# EAGLE design base_board (EAGLE 5.10)
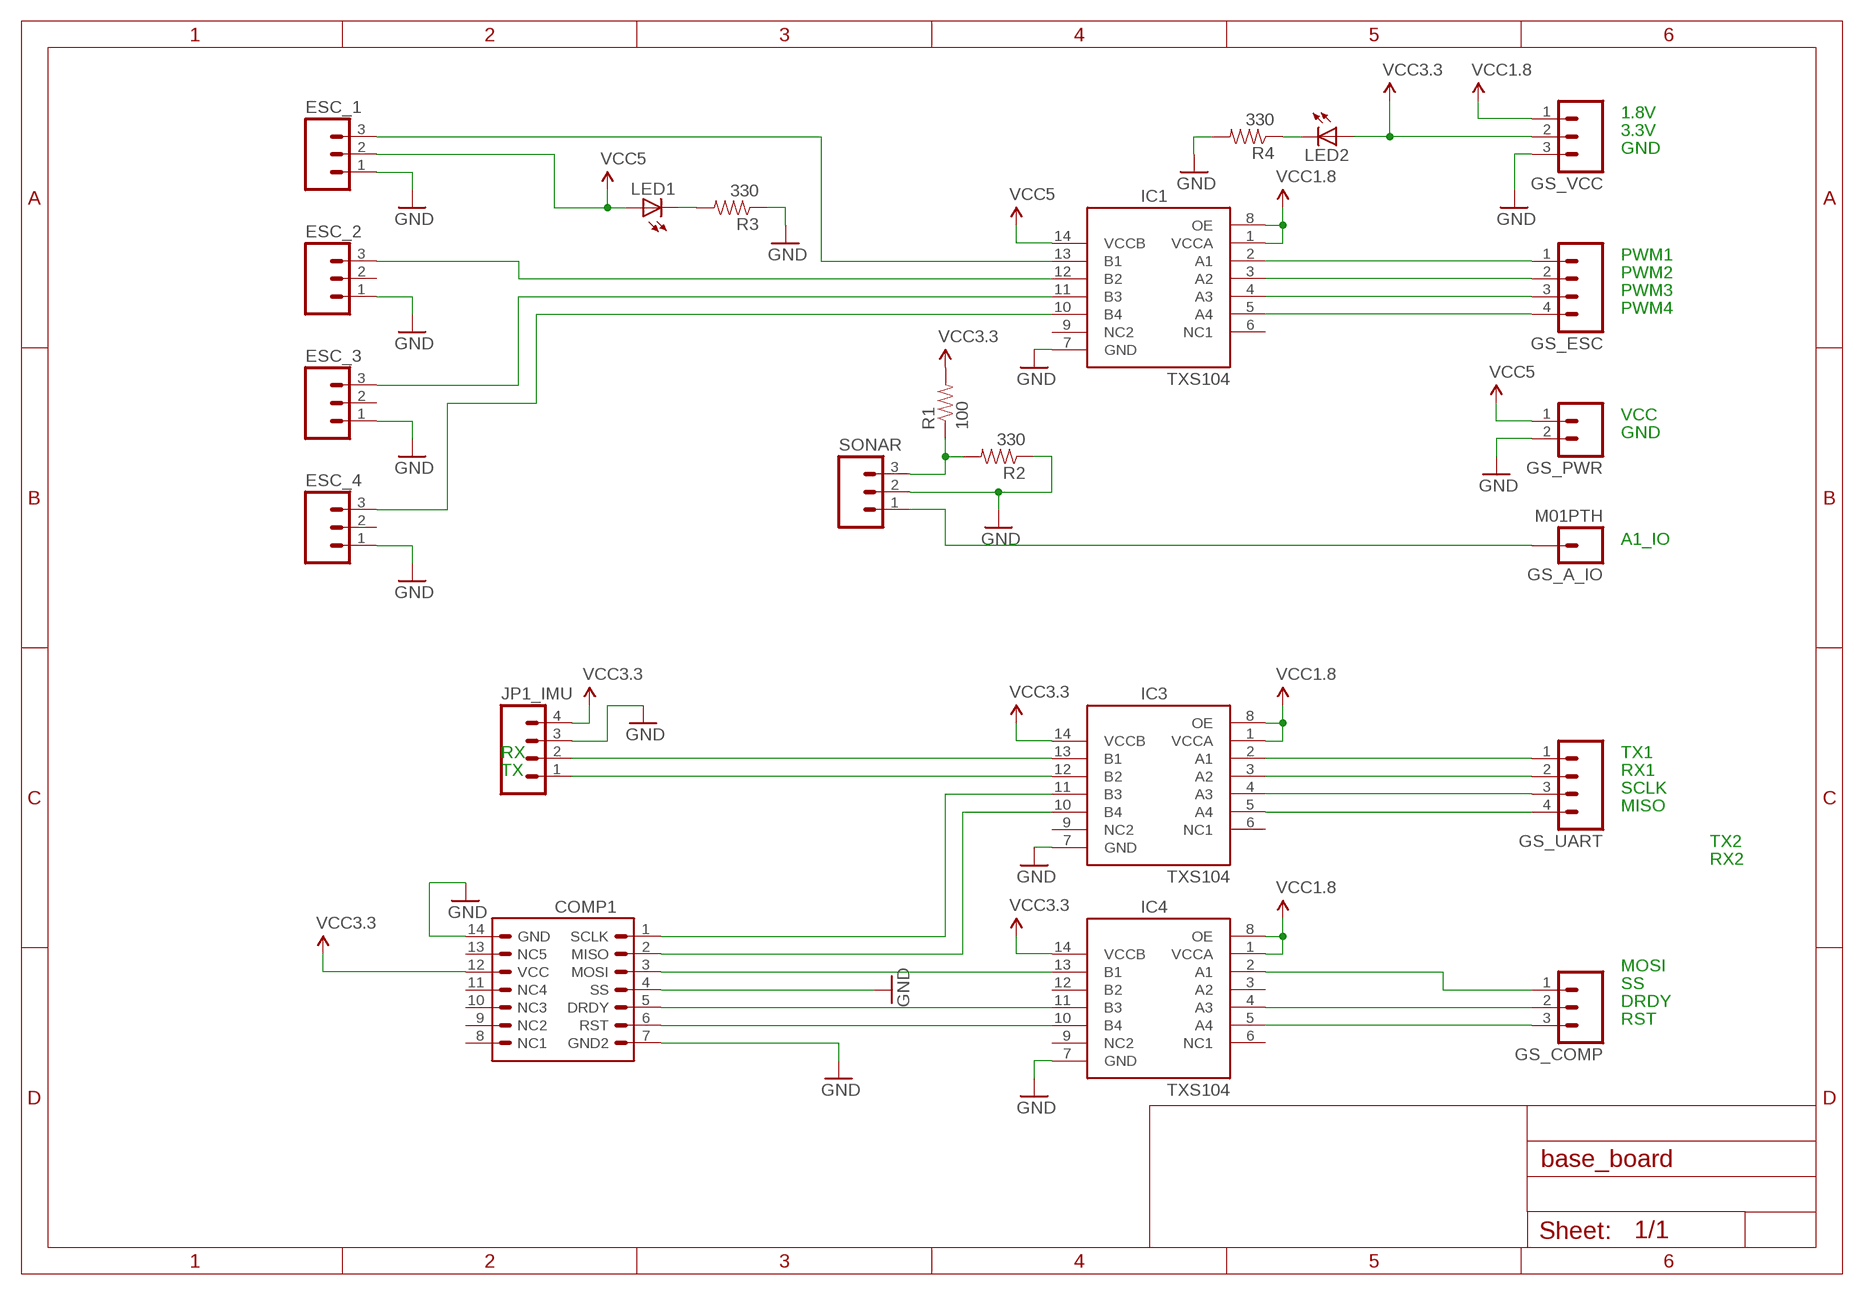
[diagram p0: schematic, sheet 1]

## Parts
COMP1  PNI11096  [PNI11096]
ESC_1  M03PTH  [1X03]
ESC_2  M03PTH  [1X03]
ESC_3  M03PTH  [1X03]
ESC_4  M03PTH  [1X03]
GS_A_IO  M01PTH  [1X01]
GS_COMP  M03LOCK  [1X03_LOCK]
GS_ESC  M04PTH  [1X04]
GS_PWR  M02PTH  [1X02]
GS_UART  M04PTH  [1X04]
GS_VCC  M03LOCK  [1X03_LOCK]
IC1  TXS104  [SOIC-14]
IC3  TXS104  [SOIC-14]
IC4  TXS104  [SOIC-14]
JP1_IMU  M04PTH  [1X04]
LED1  LED3MM  [LED3MM]
LED2  LED3MM  [LED3MM]
R1  100  RESISTOR1206  [1206]
R2  330  RESISTOR1206  [1206]
R3  330  RESISTOR1206  [1206]
R4  330  RESISTOR1206  [1206]
SONAR  M03PTH  [1X03]

## Nets
GND: COMP1.4(SS) COMP1.7(GND2) COMP1.14(GND) ESC_1.1 ESC_2.1 ESC_3.1 ESC_4.1 GS_PWR.2 GS_VCC.3 IC1.7(GND) IC3.7(GND) IC4.7(GND) JP1_IMU.3 R2.1 R3.1 R4.2 SONAR.2
N$1: GS_ESC.1 IC1.2(A1)
N$2: GS_ESC.2 IC1.3(A2)
N$3: GS_ESC.3 IC1.4(A3)
N$4: GS_ESC.4 IC1.5(A4)
N$5: GS_COMP.1 IC4.2(A1)
N$7: GS_COMP.2 IC4.4(A3)
N$8: GS_COMP.3 IC4.5(A4)
N$9: GS_UART.4 IC3.5(A4)
N$10: GS_UART.3 IC3.4(A3)
N$11: GS_UART.1 IC3.2(A1)
N$12: GS_UART.2 IC3.3(A2)
N$13: IC3.12(B2) JP1_IMU.1
N$14: IC3.13(B1) JP1_IMU.2
N$15: R1.1 R2.2 SONAR.3
N$16: ESC_4.3 IC1.10(B4)
N$17: LED1.K(C) R3.2
N$18: ESC_3.3 IC1.11(B3)
N$19: COMP1.6(RST) IC4.10(B4)
N$20: COMP1.5(DRDY) IC4.11(B3)
N$21: LED2.K(C) R4.1
N$22: COMP1.3(MOSI) IC4.13(B1)
N$23: COMP1.2(MISO) IC3.10(B4)
N$24: COMP1.1(SCLK) IC3.11(B3)
N$25: ESC_1.3 IC1.13(B1)
N$26: GS_A_IO.1 SONAR.1
N$27: ESC_2.3 IC1.12(B2)
VCC1.8: GS_VCC.1 IC1.1(VCCA) IC1.8(OE) IC3.1(VCCA) IC3.8(OE) IC4.1(VCCA) IC4.8(OE)
VCC3.3: COMP1.12(VCC) GS_VCC.2 IC3.14(VCCB) IC4.14(VCCB) JP1_IMU.4 LED2.A R1.2
VCC5: ESC_1.2 GS_PWR.1 IC1.14(VCCB) LED1.A
Unconnected: COMP1.8(NC1) COMP1.9(NC2) COMP1.10(NC3) COMP1.11(NC4) COMP1.13(NC5) ESC_2.2 ESC_3.2 ESC_4.2 IC1.6(NC1) IC1.9(NC2) IC3.6(NC1) IC3.9(NC2) IC4.3(A2) IC4.6(NC1) IC4.9(NC2) IC4.12(B2)

## Notes on the sheet
- 1.8V
- 3.3V
- GND
- PWM1
- PWM2
- PWM3
- PWM4
- VCC
- GND
- A1_IO
- RX | TX1
- TX | RX1
- SCLK
- MISO
- TX2
- RX2
- MOSI
- SS
- DRDY
- RST

## Library data of the parts
COMP1 = rk_logic:PNI11096
ESC_1-ESC_4 GS_COMP GS_VCC SONAR = SparkFun:M03: Header 3 Standard 3-pin 0.1" header. Use with straight break away headers (SKU : PRT-00116), right angle break away headers (PRT-00553), swiss pins (PRT-00743), machine pins (PRT-00117), and female headers (PRT-00115). Molex polarized connector foot print use with SKU : PRT-08232 with associated crimp pins and housings.
GS_A_IO = SparkFun:M01: Header 1 Standard 1-pin 0.1" header. Use with straight break away headers (SKU : PRT-00116), right angle break away headers (PRT-00553), swiss pins (PRT-00743), machine pins (PRT-00117), and female headers (PRT-00115).
GS_ESC GS_UART JP1_IMU = SparkFun:M04: Header 4 Standard 4-pin 0.1" header. Use with straight break away headers (SKU : PRT-00116), right angle break away headers (PRT-00553), swiss pins (PRT-00743), machine pins (PRT-00117), and female headers (PRT-00115). Molex polarized connector foot print use with SKU : PRT-08231 with associated crimp pins and housings.
GS_PWR = SparkFun:M02: Header 2 Standard 2-pin 0.1" header. Use with straight break away headers (SKU : PRT-00116), right angle break away headers (PRT-00553), swiss pins (PRT-00743), machine pins (PRT-00117), and female headers (PRT-00115). Molex polarized connector foot print use with SKU : PRT-08233 with associated crimp pins and housings.
IC1 IC3 IC4 = rk_logic:TXS104
LED1 LED2 = SparkFun:LED: LEDs Standard schematic elements and footprints for 5mm, 3mm, 1206, and 0603 sized LEDs. 5mm - Spark Fun Electronics SKU : COM-00529 (and others)
R1-R4 = SparkFun:RESISTOR: Resistor Basic schematic elements and footprints for 0603, 1206, and PTH resistors.

## Board
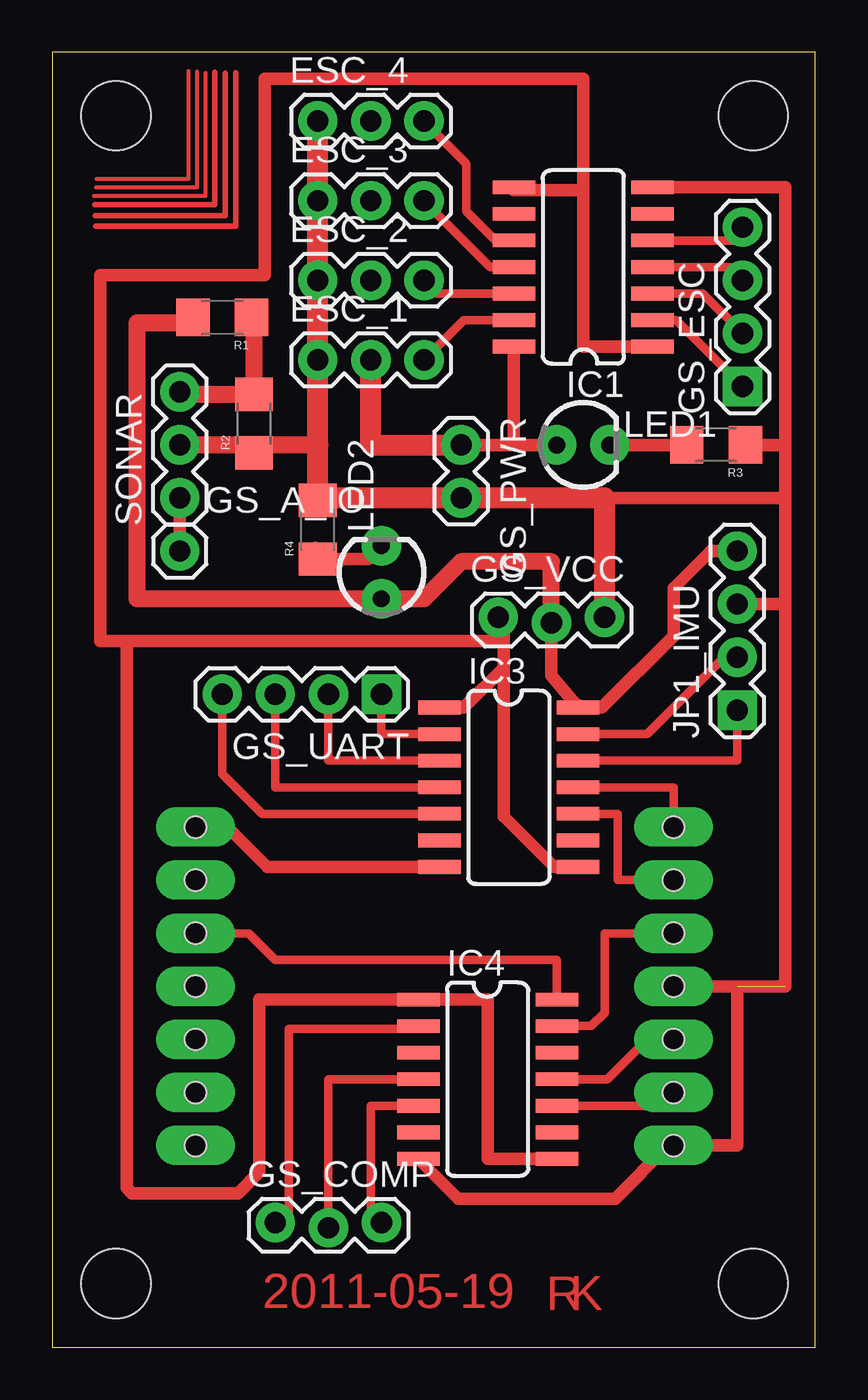
[diagram p1: board, top side]
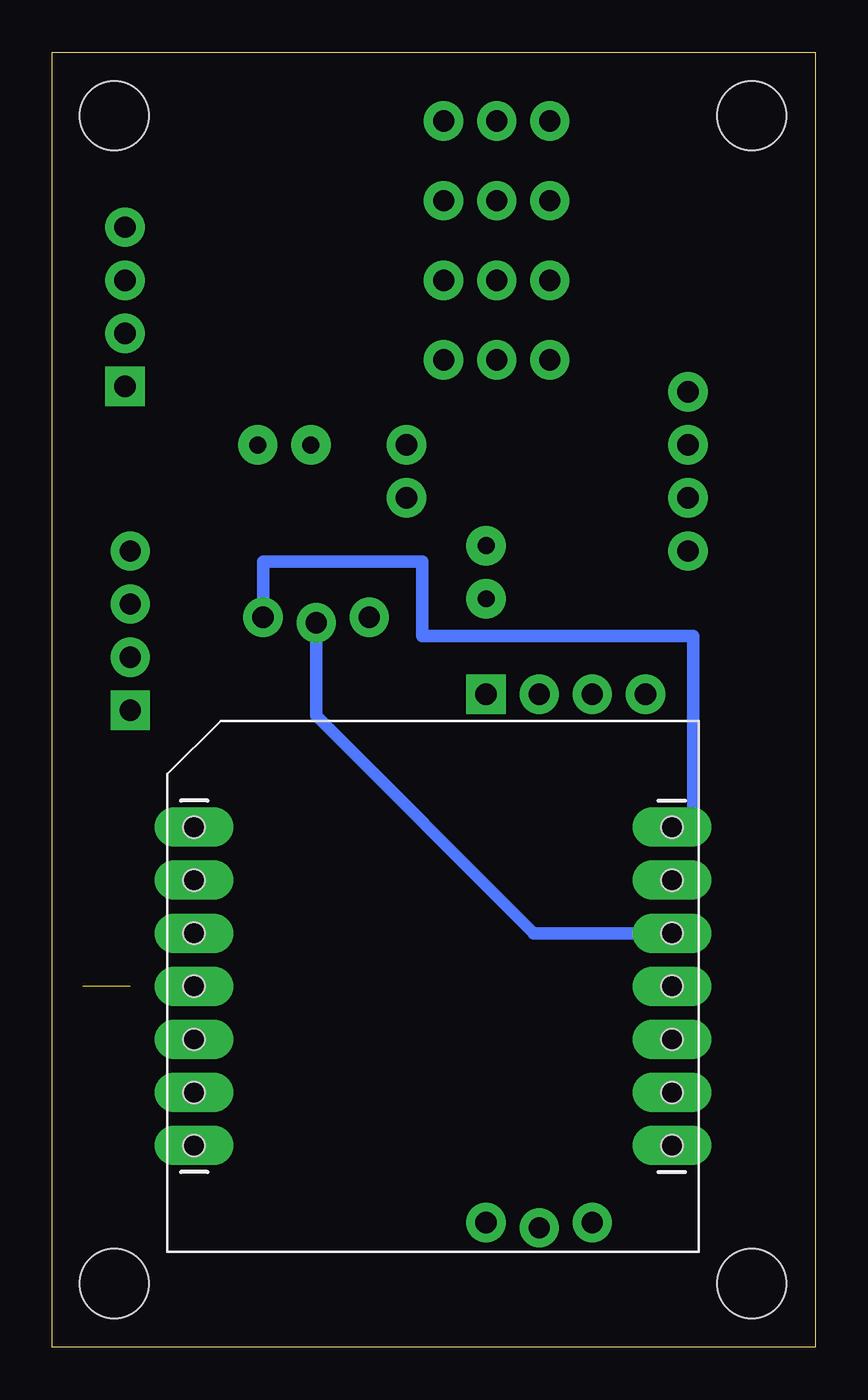
[diagram p2: board, bottom side, seen from below]

Size 36.5 x 61.97 mm. Coordinates in mm from the lower left corner, seen from the top.
Outline: 0,0 36.5,0 36.5,61.97 0,61.97 0,0
Copper layers (1*16): Top 0.035mm / dielectric 1.5mm / Bottom 0.035mm
Design rules "SparkFun": minimum track width 8mil, minimum drill 20mil, track to track 8mil, track to pad 8mil, pad to pad 8mil, via to via 8mil, smd to smd 8mil, copper to edge 10mil, drill to drill 8mil, minimum pad ring 12mil, minimum via ring 10mil, stop-mask expansion 4mil, vias tented up to drill 25mil, thermal gap 10mil

### Footprints (pad centres in the part's own frame; a part is rotated, then mirrored left to right if it is on the bottom)
PNI11096 = drill 1.016 pad 1.88 long: 1 -10.16,7.62; 2 -10.16,5.08; 3 -10.16,2.54; 4 -10.16,0; 5 -10.16,-2.54; 6 -10.16,-5.08; 7 -10.16,-7.62; 8 12.7,-7.62; 9 12.7,-5.08; 10 12.7,-2.54; 11 12.7,0; 12 12.7,2.54; 13 12.7,5.08; 14 12.7,7.62 | hole 1.016: -10.16,7.62; -10.16,5.08; -10.16,2.54; -10.16,0; -10.16,-2.54; -10.16,-5.08; -10.16,-7.62; 12.7,-7.62; 12.7,-5.08; 12.7,-2.54; 12.7,0; 12.7,2.54; 12.7,5.08; 12.7,7.62
1X03 = drill 1.016 pad 1.88 round: 1 0,0; 2 2.54,0; 3 5.08,0
1X01 = drill 1.016 pad 1.88 round: 1 0,0
1X03_LOCK = drill 1.016 pad 1.88 round: 1 0,0.127; 2 2.54,-0.127; 3 5.08,0.127
1X04 = drill 1.016 pad 1.88 square: 1 0,0 | drill 1.016 pad 1.88 round: 2 2.54,0; 3 5.08,0; 4 7.62,0
1X02 = drill 1.016 pad 1.88 round: 1 0,0; 2 2.54,0
SOIC-14 = smd 0.66 x 2.032: 1 -3.175,-3.315; 2 -1.905,-3.315; 3 -0.635,-3.315; 4 0.635,-3.315; 5 1.905,-3.315; 6 3.175,-3.315; 7 4.445,-3.315; 8 4.445,3.315; 9 3.175,3.315; 10 1.905,3.315; 11 0.635,3.315; 12 -0.635,3.315; 13 -1.905,3.315; 14 -3.175,3.315
LED3MM = drill 0.813 pad 1.88 round: A -1.27,0; K 1.27,0
1206 = smd 1.6 x 1.8: 1 -1.4,0; 2 1.4,0
STAND-OFF = hole 3.302: 0,0

### Placement (x,y rotation side)
COMP1  19.56,17.27 0 bottom
ESC_1  12.7,47.24 0 top
ESC_2  12.7,51.05 0 top
ESC_3  12.7,54.86 0 top
ESC_4  12.7,58.67 0 top
GS_A_IO  6.1,38.1 0 top
GS_COMP  10.67,5.84 0 top
GS_ESC  33.02,45.97 90 top
GS_PWR  19.56,43.18 270 top
GS_UART  15.75,31.24 180 top
GS_VCC  21.34,34.8 0 top
IC1  25.4,51.05 90 top
IC3  21.84,27.43 270 top
IC4  20.83,13.46 270 top
JP1_IMU  32.77,30.48 90 top
LED1  25.4,43.18 0 top
LED2  15.75,37.08 90 top
R1  8.13,49.28 180 top
R2  9.65,44.2 90 top
R3  31.75,43.18 180 top
R4  12.7,39.12 90 top
SONAR  6.1,40.64 90 top
U$1  [STAND-OFF]  33.53,58.93 0 top
U$2  [STAND-OFF]  33.53,3.05 0 top
U$3  [STAND-OFF]  3.05,3.05 0 top
U$4  [STAND-OFF]  3.05,58.93 0 top

### Tracks (layer width: path | path; a pad name or v marks a point on that pad's centre or on a via)
GND  (1 unrouted)
  Top 0.406: JP1_IMU.3 32.79,35.54
  Top 0.61: 35.05,40.64 35.05,35.56 | 35.05,40.64 35.05,43.18 | 35.05,43.18 R3.1 | IC1.7 35.05,55.5 35.05,43.18 | 35.05,35.56 JP1_IMU.3 | 32.77,17.27 32.77,9.65 COMP1.7 29.46,9.65 26.92,7.11 19.42,7.11 IC4.7 | 35.05,35.56 35.05,17.27 COMP1.4 | 26.42,40.64 35.05,40.64 | IC3.7 10.29,22.99 8.64,24.64 7.11,24.64 COMP1.14
  Top 0.813: SONAR.2 9.65,43.18 R2.1 10.04,43.18 12.7,43.18
  Top 1.016: GS_VCC.3 26.42,40.64 GS_PWR.2 12.7,40.64 | ESC_4.1 ESC_3.1 ESC_2.1 ESC_1.1 12.7,43.18 12.7,40.64 | 12.7,40.64 R4.2
  Bottom 0.61: COMP1.14 5.84,24.89 5.84,34.04 18.8,34.04 18.8,37.59 26.42,37.59 GS_VCC.3
N$1
  Top 0.406: GS_ESC.1 29.84,49.15 IC1.2
N$2
  Top 0.406: GS_ESC.2 31.12,50.42 IC1.3
N$3
  Top 0.406: GS_ESC.3 32.38,51.69 IC1.4
N$4
  Top 0.406: IC1.5 33.02,52.96 GS_ESC.4
N$5
  Top 0.406: GS_COMP.1 11.3,5.97 11.3,15.24 17.51,15.24 IC4.2
N$6
  Top 0.254: 8.79,60.98 8.79,53.64 2.08,53.64
N$7
  Top 0.406: IC4.4 13.21,12.83 GS_COMP.2
N$8
  Top 0.406: IC4.5 15.24,11.56 15.24,6.35
  Top 0.61: 15.24,6.35 15.62,5.97 GS_COMP.3
N$9
  Top 0.406: IC3.5 10.03,25.53 8.13,27.43 GS_UART.4
N$10
  Top 0.406: IC3.4 10.67,26.8 GS_UART.3
N$11
  Top 0.406: IC3.2 15.75,29.34 GS_UART.1
N$12
  Top 0.406: IC3.3 13.21,28.07 GS_UART.2
N$13
  Top 0.406: IC3.12 32.77,28.07 JP1_IMU.1
N$14
  Top 0.406: IC3.13 28.45,29.34 32.13,33.02 JP1_IMU.2
N$15
  Top 0.813: SONAR.3 6.22,45.6 R2.2 9.65,49.15 R1.1
N$16
  Top 0.406: IC1.10 21.21,52.96 19.81,54.36 19.81,56.64 ESC_4.3
N$17
  Top 0.61: LED1.K R3.2
N$18
  Top 0.406: IC1.11 20.95,51.69 ESC_3.3
N$19
  Top 0.406: IC4.10 29.72,11.56 COMP1.6
N$20
  Top 0.406: IC4.11 26.54,12.83 28.45,14.73 COMP1.5
N$21
  Top 0.406: 12.58,38.35 R4.1
  Top 0.61: R4.1 15.11,37.72 LED2.K
N$22
  Top 0.406: IC4.13 25.78,15.37 26.42,16 26.42,19.81 COMP1.3
N$23
  Top 0.406: COMP1.2 27.05,22.35 27.05,25.53 IC3.10
N$24
  Top 0.406: COMP1.1 29.72,26.8 IC3.11
N$25
  Top 0.406: ESC_1.3 19.69,49.15 IC1.13
N$26
  Top 0.61: GS_A_IO.1 SONAR.1
N$27
  Top 0.406: IC1.12 18.41,50.42 ESC_2.3
N$29
  Top 0.254: 8.28,60.96 8.28,54.15 2.06,54.15
N$30
  Top 0.254: 2.03,54.66 7.77,54.66 7.77,61.01
N$31
  Top 0.203: 7.34,60.98 7.34,55.09 2.01,55.09
N$33
  Top 0.203: 2.08,55.5 6.93,55.5 6.93,61.04
N$35
  Top 0.203: 2.11,55.91 6.53,55.91 6.53,61.06
VCC1.8
  Top 0.406: 22.09,55.37 IC1.8 | GS_VCC.1 21.46,34.92
  Top 0.61: IC4.8 20.83,9.02 20.83,16.64 IC4.1 9.91,16.64 9.91,8.38 8.89,7.37 3.81,7.37 3.56,7.62 3.56,33.78 | IC1.1 25.4,47.88 25.4,55.37 | 25.4,55.37 25.4,60.71 10.16,60.71 10.16,51.31 2.29,51.31 2.29,33.78 3.56,33.78 | 25.4,55.37 22.09,55.37 | 3.56,33.78 21.46,33.78 | IC3.8 24,22.99 21.59,25.4 21.59,32.51 | 21.59,33.91 21.59,34.67 21.46,33.78 | 21.59,33.91 21.59,32.51 | IC3.1 19.69,30.61 21.59,32.51 | 21.59,33.91 GS_VCC.1 | 21.46,33.78 21.59,33.91
VCC3.3
  Top 0.406: IC4.14 24.14,18.54 10.67,18.54 9.4,19.81 COMP1.12
  Top 0.61: IC3.14 23.88,32.14 GS_VCC.2 | JP1_IMU.4 31.5,38.1 29.72,36.32 29.72,34.04 26.29,30.61 IC3.14 | IC3.14 25.16,30.73
  Top 0.813: GS_VCC.2 23.88,37.59 19.56,37.59 17.78,35.81 LED2.A 4.06,35.81 4.06,49.02 6.47,49.02 R1.2
  Bottom 0.61: COMP1.12 13.46,19.81 23.88,30.23 GS_VCC.2
VCC5
  Top 0.61: 22.09,43.18 GS_PWR.1 LED1.A | 22.09,43.18 IC1.14 | 22.09,43.18 22.1,43.18
  Top 1.016: GS_PWR.1 15.24,43.18 ESC_1.2

### Text on the board
Top: 2011-05-19 | R | K